# Altium schematic sheet Sheet1.SchDoc
size B; SheetNumber: 1; SheetTotal: 1
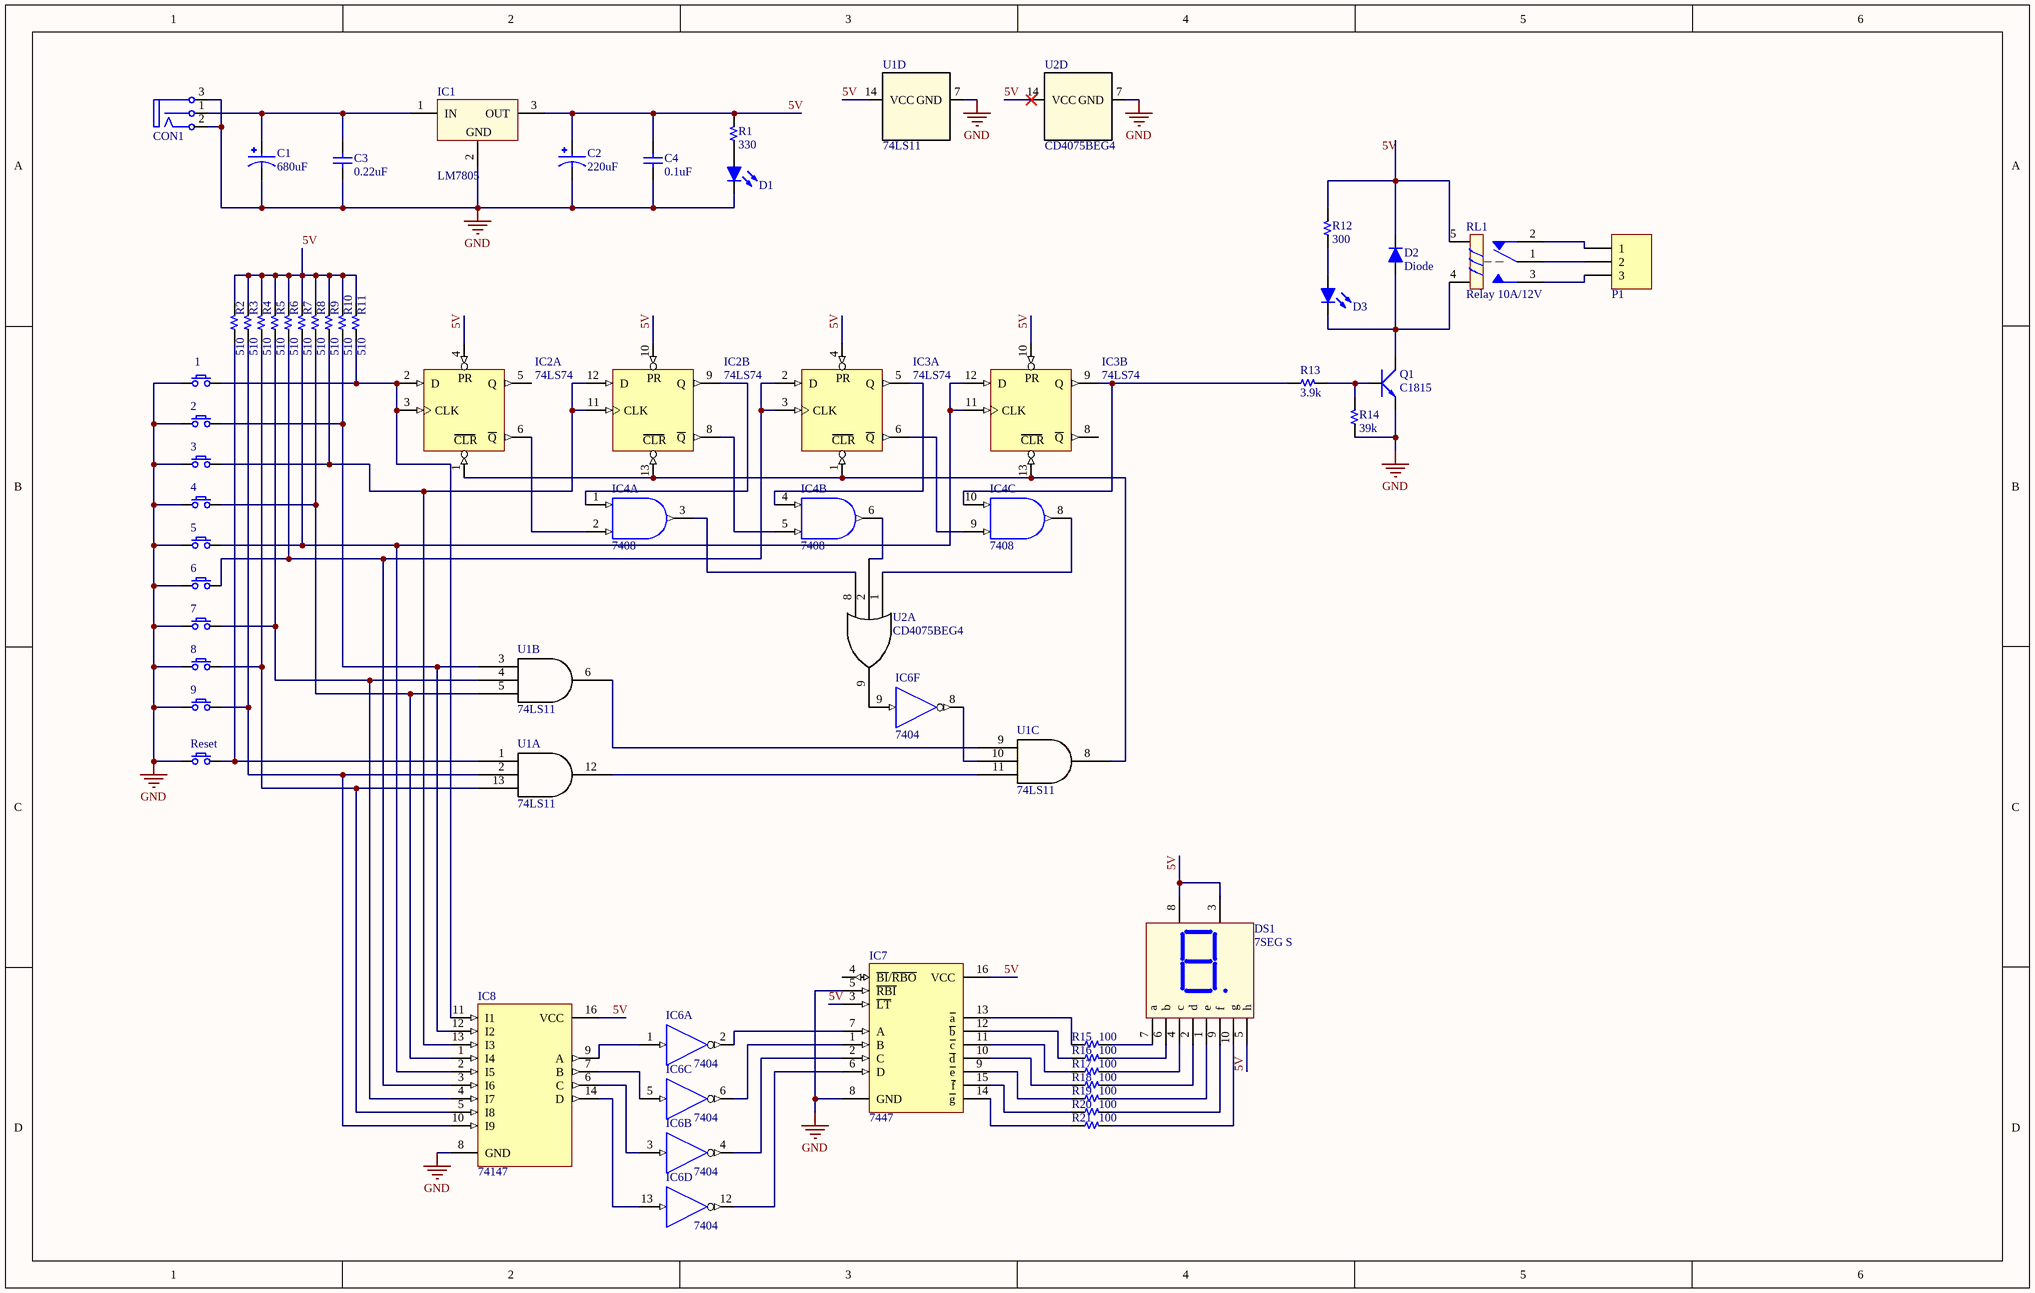
[diagram p0: Sheet1.SchDoc]

## Parts
1  Button  [Button]  (value not drawn)
2  Button  [Button]  (value not drawn)
3  Button  [Button]  (value not drawn)
4  Button  [Button]  (value not drawn)
5  Button  [Button]  (value not drawn)
6  Button  [Button]  (value not drawn)
7  Button  [Button]  (value not drawn)
8  Button  [Button]  (value not drawn)
9  Button  [Button]  (value not drawn)
C1  680uF  [CAP_EEEFK1V681AQ]
C2  220uF  [CAP_EEEFP1A681AP]
C3  0.22uF  [C 0603]
C4  0.1uF  [C 0603]
CON1  CON DC PWR  [CONN/DC/PWR/5.0MM]  (value not drawn)
D1  Led  [LED 3MM - red]  (value not drawn)
D2  Diode  [DO-214AC (SMA)]
D3  Led  [LED 3MM - red]  (value not drawn)
DS1  7SEG S  [7SEGS]
IC1  LM7805  [QTO-220]
IC2  74LS74  [DIP14/W0.3]  (parts A,B of 2)
IC3  74LS74  [DIP14/W0.3]  (parts A,B of 2)
IC4  7408  [DIP14/W0.3]  (parts A,B,C of 4)
IC6  7404  [DIP14/W0.3]  (parts A,B,C,D,F of 6)
IC7  7447  [DIP16/W0.3]
IC8  74147  [DIP16/W0.3]
P1  Domino 3  [DOMINO 3-5mm]  (value not drawn)
Q1  C1815  [SOT23B]
R1  330  [R 0603]
R2  510  [R 0603]
R3  510  [R 0603]
R4  510  [R 0603]
R5  510  [R 0603]
R6  510  [R 0603]
R7  510  [R 0603]
R8  510  [R 0603]
R9  510  [R 0603]
R10  510  [R 0603]
R11  510  [R 0603]
R12  300  [R 0603]
R13  3.9k  [R 0603]
R14  39k  [R 0603]
R15  100  [R 0603]
R16  100  [R 0603]
R17  100  [R 0603]
R18  100  [R 0603]
R19  100  [R 0603]
R20  100  [R 0603]
R21  100  [R 0603]
Reset  Button  [Button]  (value not drawn)
RL1  Relay 10A/12V  [RL_SPDT_10A]
U1  74LS11  [SO14NB_TEX]  (parts A,B,C,D of 4)
U2  CD4075BEG4  [N14_TEX]  (parts A,D of 4)

## Nets
GND: 1.1 2.1 3.1 4.1 5.1 6.1 7.1 8.1 9.1 C1.2 C2.2 C3.2 C4.2 CON1.2(T) CON1.3(TN) D1.2(K) IC1.2(GND) IC2.7(GND) IC3.7(GND) IC4.7(GND) IC6.7(GND) IC7.5(~{RBI}) IC7.8(GND) IC8.8(GND) Q1.1(E) R14.1 Reset.1 U1.7(GND) U2.7(GND)
VCC: IC2.14(VCC) IC3.14(VCC) IC4.14(VCC) IC6.14(VCC)
5V: C2.1 C4.1 DS1.3(Vcc) DS1.5(h) DS1.8(Vcc) IC1.3(OUT) IC2.4(PR) IC2.10(PR) IC3.4(PR) IC3.10(PR) IC7.3(~{LT}) IC7.16(VCC) IC8.16(VCC) R1.2 R2.2 R3.2 R4.2 R5.2 R6.2 R7.2 R8.2 R9.2 R10.2 R11.2 U1.14(VCC) U2.14(VCC)
Net1_2: 1.2 IC2.2(D) IC2.3(CLK) IC8.11(I1) R11.1
Net2_2: 2.2 IC8.12(I2) R10.1 U1.3(A)
Net3_2: 3.2 IC2.11(CLK) IC2.12(D) IC8.13(I3) R9.1
Net4_2: 4.2 IC8.1(I4) R8.1 U1.5(C)
Net5_2: 5.2 IC3.11(CLK) IC3.12(D) IC8.2(I5) R7.1
Net6_2: 6.2 IC3.2(D) IC3.3(CLK) IC8.3(I6) R6.1
Net7_2: 7.2 IC8.4(I7) R5.1 U1.4(B)
Net8_2: 8.2 IC8.5(I8) R4.1 U1.13(C)
Net9_2: 9.2 IC8.10(I9) R3.1 U1.2(B)
NetC1_1: C1.1 C3.1 CON1.1(S) IC1.1(IN)
NetD1_1: D1.1(A) R1.1
NetD2_1: D2.1(A) D3.2(K) Q1.2(C) RL1.4
NetD2_2: D2.2(K) R12.2 RL1.5
NetD3_1: D3.1(A) R12.1
NetDS1_1: DS1.1(e) R19.2
NetDS1_2: DS1.2(d) R18.2
NetDS1_4: DS1.4(c) R17.2
NetDS1_6: DS1.6(b) R16.2
NetDS1_7: DS1.7(a) R15.2
NetDS1_9: DS1.9(f) R20.2
NetDS1_10: DS1.10(g) R21.2
NetIC2_1: IC2.1(CLR) IC2.13(CLR) IC3.1(CLR) IC3.13(CLR) U1.8(Y)
NetIC2_6: IC2.6(~{Q}) IC4.2(B)
NetIC2_8: IC2.8(~{Q}) IC4.5(B)
NetIC2_9: IC2.9(Q) IC4.1(A)
NetIC3_5: IC3.5(Q) IC4.4(A)
NetIC3_6: IC3.6(~{Q}) IC4.9(B)
NetIC3_9: IC3.9(Q) IC4.10(A) R13.1
NetIC4_3: IC4.3(O) U2.8(C)
NetIC4_6: IC4.6(O) U2.2(B)
NetIC4_8: IC4.8(O) U2.1(A)
NetIC6_1: IC6.1(A) IC8.9(A)
NetIC6_2: IC6.2(~{O}) IC7.7(A)
NetIC6_3: IC6.3(A) IC8.6(C)
NetIC6_4: IC6.4(~{O}) IC7.2(C)
NetIC6_5: IC6.5(A) IC8.7(B)
NetIC6_6: IC6.6(~{O}) IC7.1(B)
NetIC6_8: IC6.8(~{O}) U1.10(B)
NetIC6_9: IC6.9(A) U2.9(J)
NetIC6_12: IC6.12(~{O}) IC7.6(D)
NetIC6_13: IC6.13(A) IC8.14(D)
NetIC7_9: IC7.9(~{e}) R19.1
NetIC7_10: IC7.10(~{d}) R18.1
NetIC7_11: IC7.11(~{c}) R17.1
NetIC7_12: IC7.12(~{b}) R16.1
NetIC7_13: IC7.13(~{a}) R15.1
NetIC7_14: IC7.14(~{g}) R21.1
NetIC7_15: IC7.15(~{f}) R20.1
NetP1_1: P1.1 RL1.2
NetP1_2: P1.2 RL1.1
NetP1_3: P1.3 RL1.3
NetQ1_3: Q1.3(B) R13.2 R14.2
NetR2_1: R2.1 Reset.2 U1.1(A)
NetU1_6: U1.6(Y) U1.9(A)
NetU1_11: U1.11(C) U1.12(Y)

Not connected (* = marked no-connect by the designer): IC2 5(Q); IC3 8(~{Q}); IC7 4(~{BI}/~{RBO})

## Notes on the sheet
- Labels drawn without touching a wire or pin: 5V

## Library data of the parts
1-9 Reset = SW SPST: Tact switch 2 pin
C1 = EEEFK1V681AQ: ìº¡ ì•Œë£¨ë¯¸ëŠ„ Lytic 680uF 35V 20 % (12.5 X 13.5mm) SMD 1100mA 5000h 105C ìžë™ì°¨ T / R; MF: Panasonic; Check_prices: https://www.snapeda.com/parts/EEEFK1V681AQ/Panasonic/view-part/4273057/?ref=eda; SnapEDA_Link: https://www.snapeda.com/parts/EEEFK1V681AQ/Panasonic/view-part/4273057/?ref=snap; Price: None; Availability: Not in stock; Package: RADIAL-2 Panasonic; MP: EEEFK1V681AQ; Value: *
C2 = EEEFP1A681AP: CAPACITOR ALUM ELEC, 680UF, 10V, 20%, SMD; Product Range:PANASONIC - FP Series; Capacitance:680ÂµF; Capacitance Tolerance:Â± 20%; Voltage Rating:10V; Diameter:8mm; ESR:0.08ohm; Height:10.2mm; Life Time @ Temperature:2000 hours @ 105Â°C ;RoHS Compliant: Yes; MP: EEE-FP1A681AP; Package: RADIAL-2 Panasonic; Purchase-URL: https://pricing.snapeda.com/search/part/EEE-FP1A681AP/?ref=eda; Price: None; Availability: In Stock; Check_prices: https://www.snapeda.com/parts/EEE-FP1A681AP/Panasonic/view-part/?ref=eda; Value: *; MF: Panasonic; SnapEDA_Link: https://www.snapeda.com/parts/EEE-FP1A681AP/Panasonic/view-part/?ref=snap
C3 C4 = Capacitor NP: Capacitor non-pol
CON1 = CON DC PWR: DC input connector
D1 D3 = Led: Typical LED
D2 = Diode: Default Diode
DS1 = LED7S: Single 7 Seg Dipslay; Value: LED 7S SEG
IC1 = LM78xx: On ap +, from + 5 to + 24VDC; Value: LM7805
IC2 IC3 = 7474: Dual D Flip-Flop; Value: 74LS74; Copyright by: VanDungEvn@Gmail.com
IC4 = 7408: Quad 2-Input AND Gate; Value: 7408
IC6 = 7404: Hex Inverter; Code_IPC: SOIC127P600-14; ComponentLink1Description: Manufacturer Link; ComponentLink1URL: http://www.national.com/; ComponentLink2Description: Datasheet; ComponentLink2URL: http://www.fairchildsemi.com/ds/74/74F04.pdf; Value: 7404
IC7 = 7447: BCD to 7-Segment Decoder/Driver; Value: 7447 , 74247
IC8 = 74147: 10-Line to 4-Line Priority Encoder; Copyright by: VanDungEvn@Gmail.com
P1 = Domino 3: Domino 3-Pin; LatestRevisionDate: 17-Jul-2002; LatestRevisionNote: Re-released for DXP Platform.; Publisher: Altium Limited
Q1 = C1815: NPN 600mW, ECB; Value: C1815
R1-R21 = Resistor
RL1 = Relay 1: Relay SPDT,10A - 12VDC 5 Pin; Value: Relay SPDT, 10A, 12V
U1 = 74LS11: No Description Available; Mfr_Name: Texas Instruments; Copyright: Copyright (C) 2021 Ultra Librarian. All rights reserved.; Manufacturer_Part_Number: 74LS11; RefDes: RefDes; Type: DEV
U2 = CD4075BEG4: No Description Available; Mfr_Name: Texas Instruments; Copyright: Copyright (C) 2021 Ultra Librarian. All rights reserved.; Manufacturer_Part_Number: CD4075BEG4; RefDes: RefDes; Type: DEV